# EAGLE design pc_healthypi_5.2_display_st7796 (EAGLE 9.6.2)
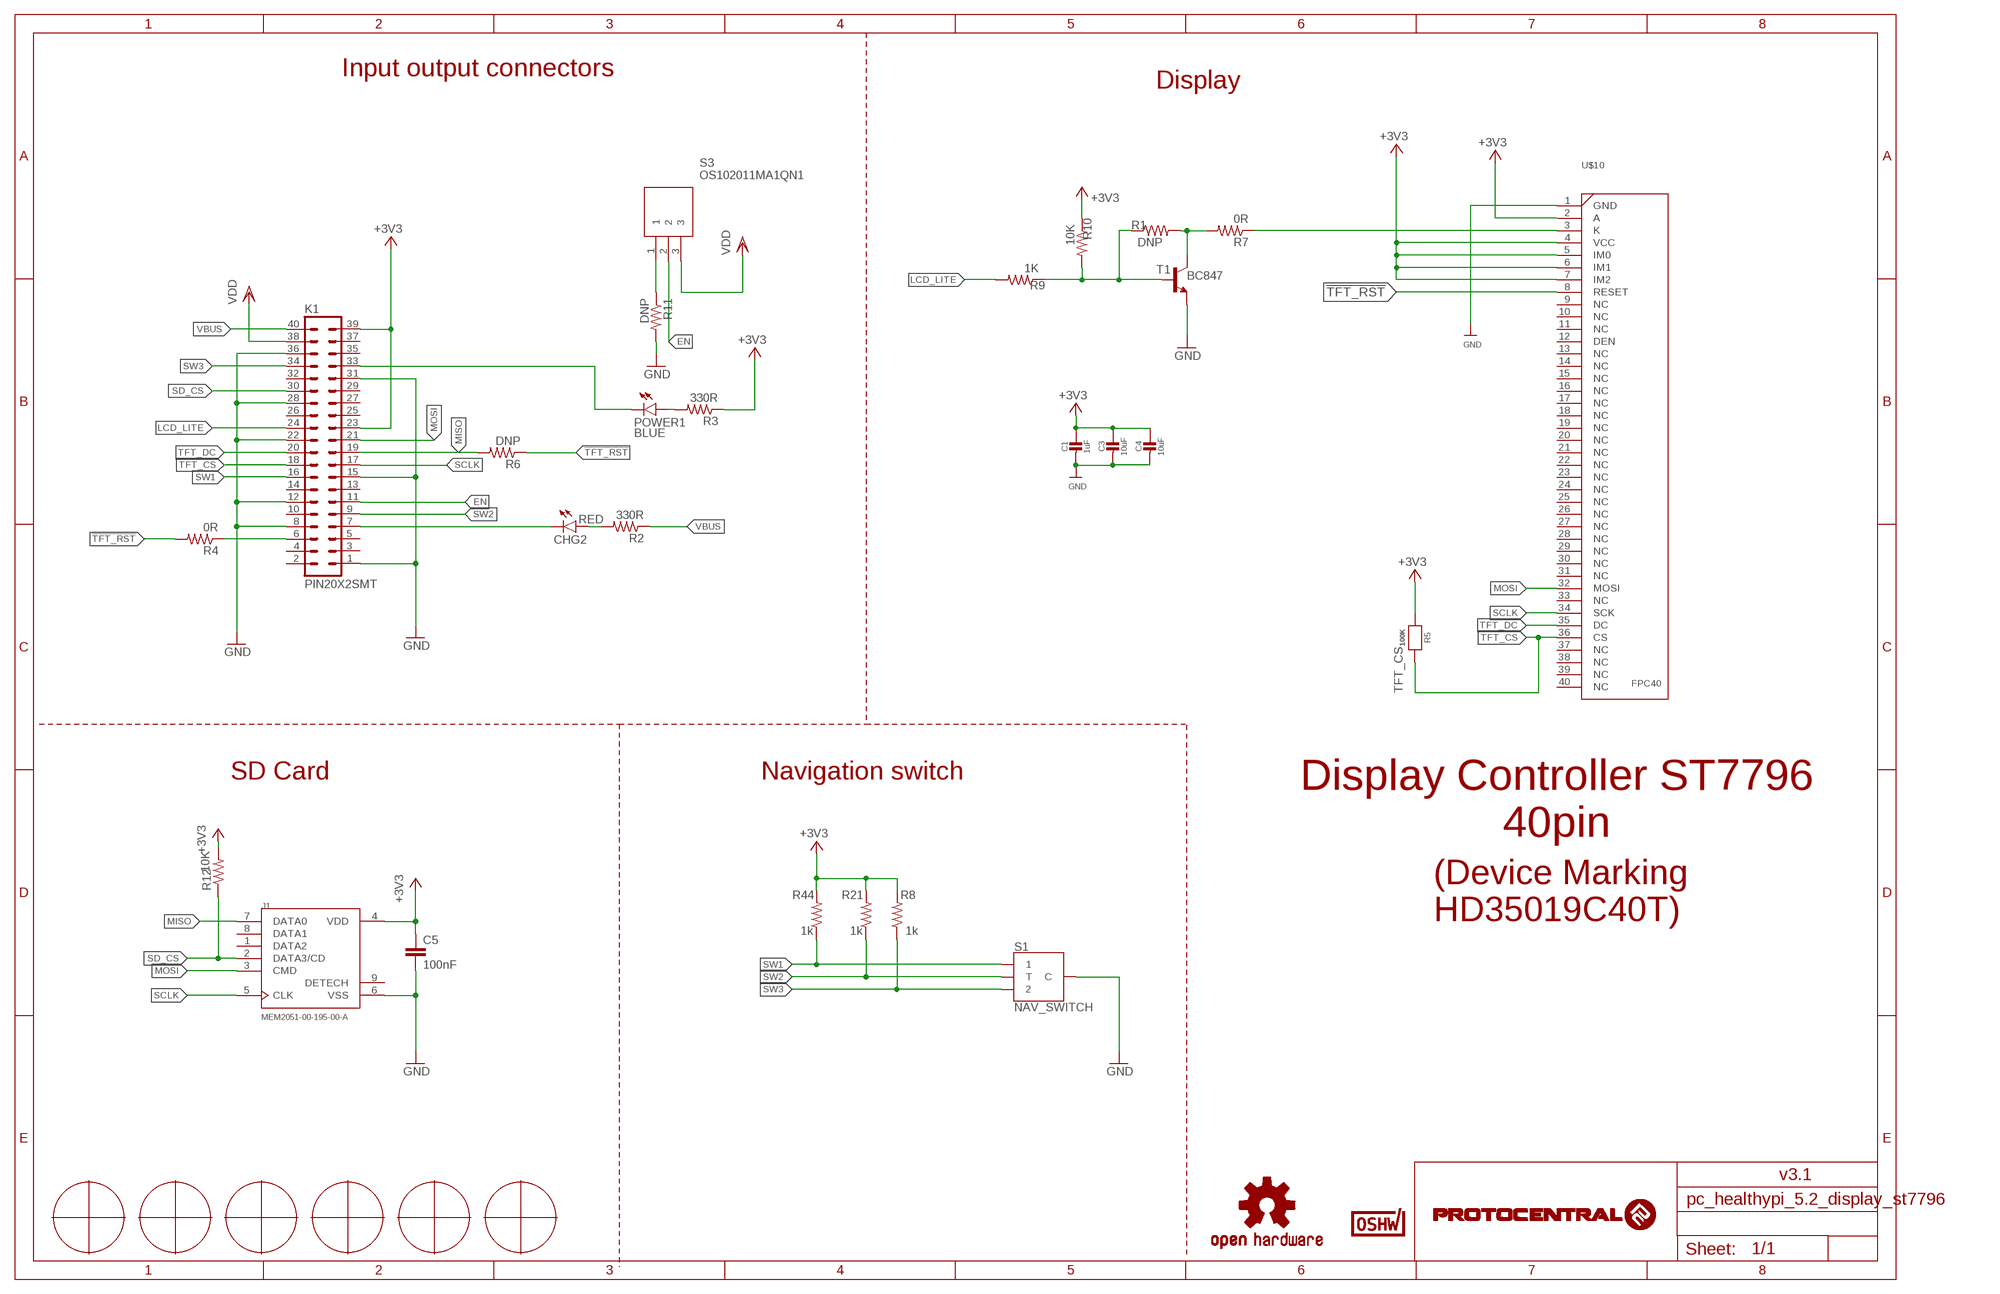
[diagram p0: schematic, sheet 1]

## Parts
C1  1uF  CAP_CERAMIC0805-NOOUTLINE  [0805-NO]
C3  10uF  CAP_CERAMIC0805-NOOUTLINE  [0805-NO]
C4  10uF  CAP_CERAMIC0805-NOOUTLINE  [0805-NO]
C5  100nF  C-EUC0402  [C0402]
CHG2  RED  LEDCHIPLED_0603  [CHIPLED_0603]
J1  MEM2051-00-195-00-A  [GCT_MEM2051-00-195-00-A]
K1  PIN20X2SMT  [20X2SMT]
POWER1  BLUE  LEDCHIPLED_0603  [CHIPLED_0603]
R1  DNP  R-US_R0402  [R0402]
R2  330R  R-US_R0402  [R0402]
R3  330R  R-US_R0402  [R0402]
R4  0R  R-US_R0402  [R0402]
R5  100K  RESISTOR0805_NOOUTLINE  [0805-NO]
R6  DNP  R-US_R0402  [R0402]
R7  0R  R-US_R0805  [R0805]
R8  1k  RESISTOR0402  [0402]
R9  1K  R-US_R0402  [R0402]
R10  10K  R-US_R0402  [R0402]
R11  DNP  R-US_R0402  [R0402]
R12  10K  R-US_R0402  [R0402]
R21  1k  RESISTOR0402  [0402]
R44  1k  RESISTOR0402  [0402]
S1  NAV_SWITCH  [NAV_SWITCH]
S3  OS102011MA1QN1  [OS102011MA1QN1]
T1  BC847  MMBT2222ALT1-NPN-SOT23-BEC  [SOT23-BEC]
U$1  FUDCIALPOINTS  [FIDUCIALPOINTS]
U$3  FUDCIALPOINTS  [FIDUCIALPOINTS]
U$5  OSHW-LOGOM  [OSHW-LOGO-M]
U$7  FUDCIALPOINTS  [FIDUCIALPOINTS]
U$8  FUDCIALPOINTS  [FIDUCIALPOINTS]
U$10  FPC40  [FPC40PIN]
U$13  CERT-SMALL  [CERT-SMALL-SILK]
U$23  FUDCIALPOINTS  [FIDUCIALPOINTS]
U$25  FUDCIALPOINTS  [FIDUCIALPOINTS]

## Nets
!TFT_RST: R4.2 R6.1 U$10.8(RESET)
+3V3: C1.1 C3.1 C4.1 C5.1 J1.4(VDD) K1.23 K1.39 R3.1 R5.2 R8.2 R10.1 R12.2 R21.2 R44.2 U$10.2(A) U$10.4(VCC) U$10.5(IM0) U$10.6(IM1) U$10.7(IM2)
EN: K1.11 S3.2
GND: C1.2 C3.2 C4.2 C5.2 J1.6(VSS) K1.1 K1.8 K1.12 K1.15 K1.22 K1.28 K1.31 K1.36 R11.2 S1.C T1.E U$10.1(GND)
LCD_LITE: K1.24 R9.2
LED1: K1.33 POWER1.C
MISO: J1.7(DATA0) K1.19 R6.2
MOSI: J1.3(CMD) K1.21 U$10.32(MOSI)
N$1: R1.2 R7.2 T1.C
N$2: CHG2.C K1.7
N$3: K1.6 R4.1
N$4: R7.1 U$10.3(K)
N$5: POWER1.A R3.2
N$6: CHG2.A R2.2
N$8: R11.1 S3.1
N$10: R1.1 R9.1 R10.2 T1.B
SCLK: J1.5(CLK) K1.17 U$10.34(SCK)
SD_CS: J1.2(DATA3/CD) K1.30 R12.1
SW1: K1.16 R44.1 S1.1
SW2: K1.9 R21.1 S1.T
SW3: K1.34 R8.1 S1.2
TFT_CS: K1.18 R5.1 U$10.36(CS)
TFT_DC: K1.20 U$10.35(DC)
VBUS: K1.40 R2.1
VDD: K1.38 S3.3
Unconnected: J1.1(DATA2) J1.8(DATA1) J1.9(DETECH) K1.2 K1.3 K1.4 K1.5 K1.10 K1.13 K1.14 K1.25 K1.26 K1.27 K1.29 K1.32 K1.35 K1.37 U$10.9(NC) U$10.10(NC) U$10.11(NC) U$10.12(DEN) U$10.13(NC) U$10.14(NC) U$10.15(NC) U$10.16(NC) U$10.17(NC) U$10.18(NC) U$10.19(NC) U$10.20(NC) U$10.21(NC) U$10.22(NC) U$10.23(NC) U$10.24(NC) U$10.25(NC) U$10.26(NC) U$10.27(NC) U$10.28(NC) U$10.29(NC) U$10.30(NC) U$10.31(NC) U$10.33(NC) U$10.37(NC) U$10.38(NC) U$10.39(NC) U$10.40(NC)

## Notes on the sheet
- Input output connectors
- Display
- SD Card | Navigation switch
- Display Controller ST7796
  40pin
- (Device Marking
  HD35019C40T)
- v3.1

## Library data of the parts
C1 C3 C4 = microbuilder:CAP_CERAMIC: Ceramic Capacitors For new designs, use the packages preceded by an '_' character since they are more reliable: The following footprints should be used on most boards: _0402 - Standard footprint for regular board layouts _0603 - Standard footprint for regular board layouts _0805 - Standard footprint for regular board layouts _1206 - Standard footprint for regular board layouts For extremely tight-pitch boards where space is at a premium, the following 'micro-pitch' footprints can be used (smaller pads, no silkscreen outline, etc.): _0402MP - Micro-pitch footprint for very dense/compact boards _0603MP - Micro-pitch footprint for very dense/compact boards _0805MP - Micro-pitch footprint for very dense/compact boards _1206MP - Micro-pitch footprint for very dense/compact boards
C5 = rcl:C-EU: CAPACITOR, European symbol
CHG2 POWER1 = led:LED: LED OSRAM: - CHIPLED LG R971, LG N971, LY N971, LG Q971, LY Q971, LO R971, LY R971 LH N974, LH R974 LS Q976, LO Q976, LY Q976 LO Q996 - Hyper CHIPLED LW Q18S LB Q993, LB Q99A, LB R99A - SideLED LS A670, LO A670, LY A670, LG A670, LP A670 LB A673, LV A673, LT A673, LW A673 LH A674 LY A675 LS A676, LA A676, LO A676, LY A676, LW A676 LS A679, LY A679, LG A679 - Hyper Micro SIDELED® LS Y876, LA Y876, LO Y876, LY Y876 LT Y87S - SmartLED LW L88C, LW L88S LB L89C, LB L89S, LG L890 LS L89K, LO L89K, LY L89K LS L896, LA L896, LO L896, LY L896 - TOPLED LS T670, LO T670, LY T670, LG T670, LP T670 LSG T670, LSP T670, LSY T670, LOP T670, LYG T670 LG T671, LOG T671, LSG T671 LB T673, LV T673, LT T673, LW T673 LH T674 LS T676, LA T676, LO T676, LY T676, LB T676, LH T676, LSB T676, LW T676 LB T67C, LV T67C, LT T67C, LS T67K, LO T67K, LY T67K, LW E67C LS E67B, LA E67B, LO E67B, LY E67B, LB E67C, LV E67C, LT E67C LW T67C LS T679, LY T679, LG T679 LS T770, LO T770, LY T770, LG T770, LP T770 LB T773, LV T773, LT T773, LW T773 LH T774 LS E675, LA E675, LY E675, LS T675 LS T776, LA T776, LO T776, LY T776, LB T776 LHGB T686 LT T68C, LB T68C - Hyper Mini TOPLED® LB M676 - Mini TOPLED Santana® LG M470 LS M47K, LO M47K, LY M47K Source: http://www.osram.convergy.de LUXEON: - LUMILED® LXK2-PW12-R00, LXK2-PW12-S00, LXK2-PW14-U00, LXK2-PW14-V00 LXK2-PM12-R00, LXK2-PM12-S00, LXK2-PM14-U00 LXK2-PE12-Q00, LXK2-PE12-R00, LXK2-PE12-S00, LXK2-PE14-T00, LXK2-PE14-U00 LXK2-PB12-K00, LXK2-PB12-L00, LXK2-PB12-M00, LXK2-PB14-N00, LXK2-PB14-P00, LXK2-PB14-Q00 LXK2-PR12-L00, LXK2-PR12-M00, LXK2-PR14-Q00, LXK2-PR14-R00 LXK2-PD12-Q00, LXK2-PD12-R00, LXK2-PD12-S00 LXK2-PH12-R00, LXK2-PH12-S00 LXK2-PL12-P00, LXK2-PL12-Q00, LXK2-PL12-R00 Source: www.luxeon.com KINGBRIGHT: KA-3528ASYC Source: www.kingbright.com
J1 = circuitects:MEM2051-00-195-00-A: Connector, Memory Card, Micro Sd, 8 Position, 1.1mm, Full Reel Check availability <https://pricing.snapeda.com/parts/MEM2051-00-195-00-A/Global%20Connector%20Technology/view-part?ref=eda>; AVAILABILITY: In Stock; DESCRIPTION: 9 (8 + 1) Position Card Connector microSD Surface Mount, Right Angle Gold, 1.95mm profile, Normally open switch, Push push, Top mount; MF: Global Connector Technology; MP: MEM2051-00-195-00-A; PACKAGE: None; PRICE: None; PURCHASE-URL: https://pricing.snapeda.com/search/part/MEM2051-00-195-00-A/?ref=eda
K1 = circuitects:PIN20X2
R1-R4 R6 R7 R9-R11 = rcl:R-US_: RESISTOR, American symbol; SPICEPREFIX: R
R5 = microbuilder:RESISTOR: Resistors For new designs, use the packages preceded by an '_' character since they are more reliable: The following footprints should be used on most boards: _0402 - Standard footprint for regular board layouts _0603 - Standard footprint for regular board layouts _0805 - Standard footprint for regular board layouts _1206 - Standard footprint for regular board layouts For extremely tight-pitch boards where space is at a premium, the following 'micro-pitch' footprints can be used (smaller pads, no silkscreen outline, etc.): _0402MP - Micro-pitch footprint for very dense/compact boards _0603MP - Micro-pitch footprint for very dense/compact boards _0805MP - Micro-pitch footprint for very dense/compact boards _1206MP - Micro-pitch footprint for very dense/compact boards
R8 R21 R44 = SparkFun-Resistors:RESISTOR: Generic Resistor Package
R12 = rcl:R-US_: RESISTOR, American symbol
S1 = SparkFun-Switches:NAV_SWITCH: Navigation Switch Three way navigation switch. Commonly used as up/down/select on MP3 players. Schematic element and footprint production proven. SparkFun Products Surface Mount Navigation Switch <https://www.sparkfun.com/products/8184> (COM-08184) Used on SparkFun MP3 Trigger <https://www.sparkfun.com/products/13720>; PROD_ID: SWCH-08301; SF_SKU: COM-08184
S3 = circuitects:OS102011MA1QN1: Switch Slide Right Angle SPDT 0.1A 12VDC Through Hole Slide Switch SPDT On-On 0.1 A@ 12 V dc Slide Source: Datasheet <http://www.ckswitches.com/media/1428/os.pdf> Check availability <https://pricing.snapeda.com/parts/OS102011MA1QN1/C%20%26%20K/view-part?ref=eda>; AVAILABILITY: In Stock; DESCRIPTION: C & K Through Hole Slide Switch Single Pole Double Throw (SPDT) Latching 100 mA@ 12 V dc Slide; MF: C & K; MP: OS102011MA1QN1; PACKAGE: None; PRICE: None; PURCHASE-URL: https://pricing.snapeda.com/search/part/OS102011MA1QN1/?ref=eda
T1 = transistor:*-NPN-: NPN Transistror BF959 corrected 2008.03.06
U$1 U$3 U$7 U$8 U$23 U$25 = circuitects:FUDCIALPOINTS
U$5 = SparkFun:OSHW-LOGO: Open Source Hardware Logo This logo indicates the piece of hardware it is found on incorporates a OSHW license and/or adheres to the definition of open source hardware found here: http://freedomdefined.org/OSHW
U$10 = circuitects:FPC40
U$13 = OSHWA:CERT

## Net classes
1 power: width 0.178 mm
2 Clock: width 0.089 mm, clearance 0.178 mm
4 USBpair: width 0.102 mm, drill 0.1 mm, clearance 0.15 mm to class 3

## Board
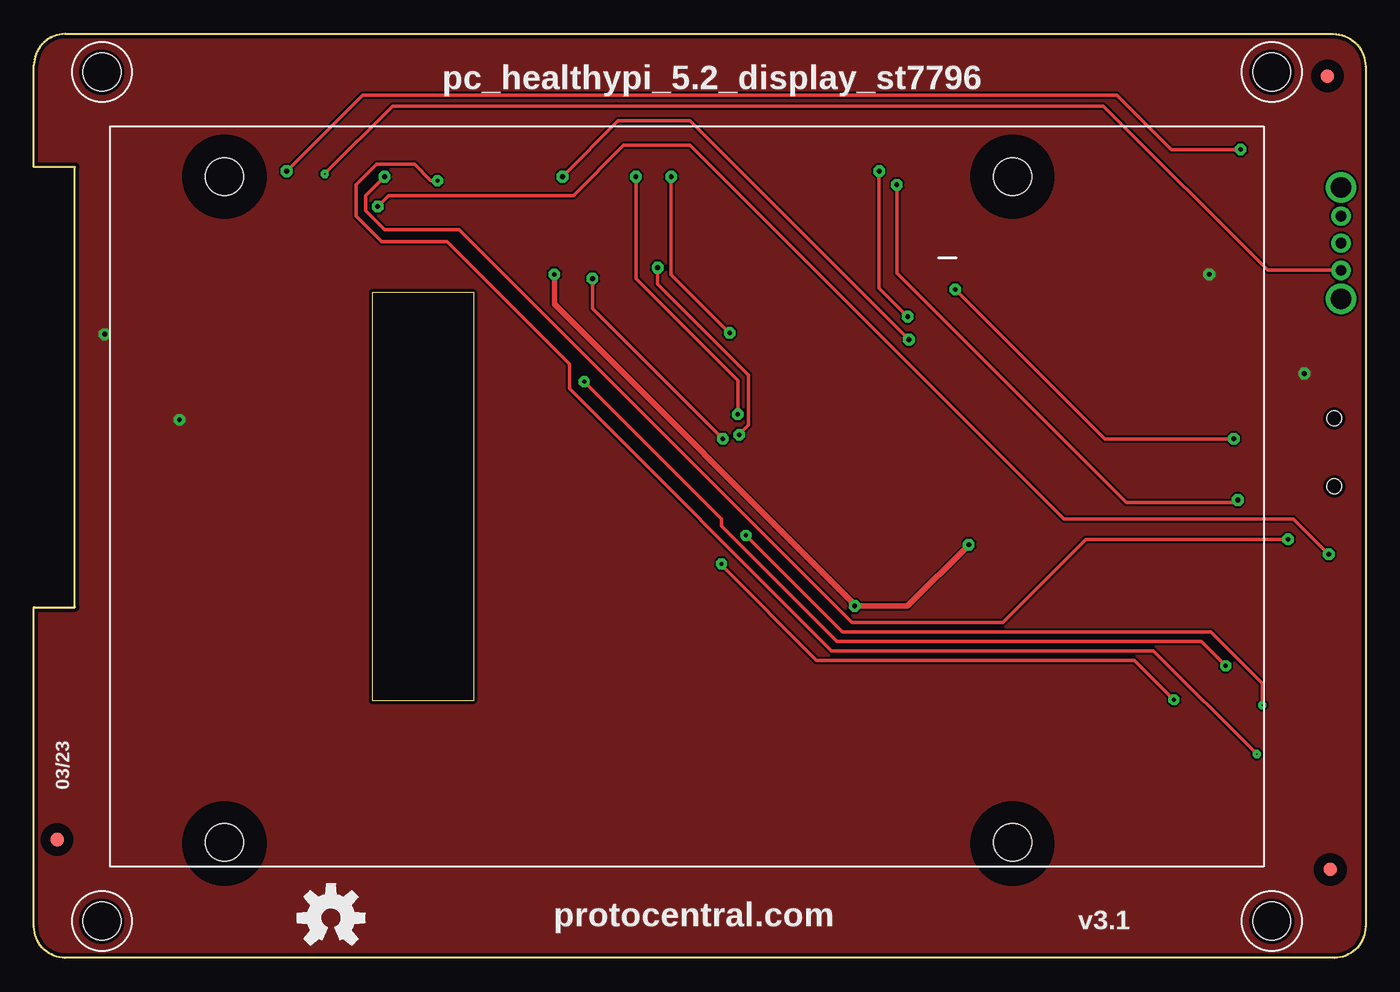
[diagram p1: board, top side]
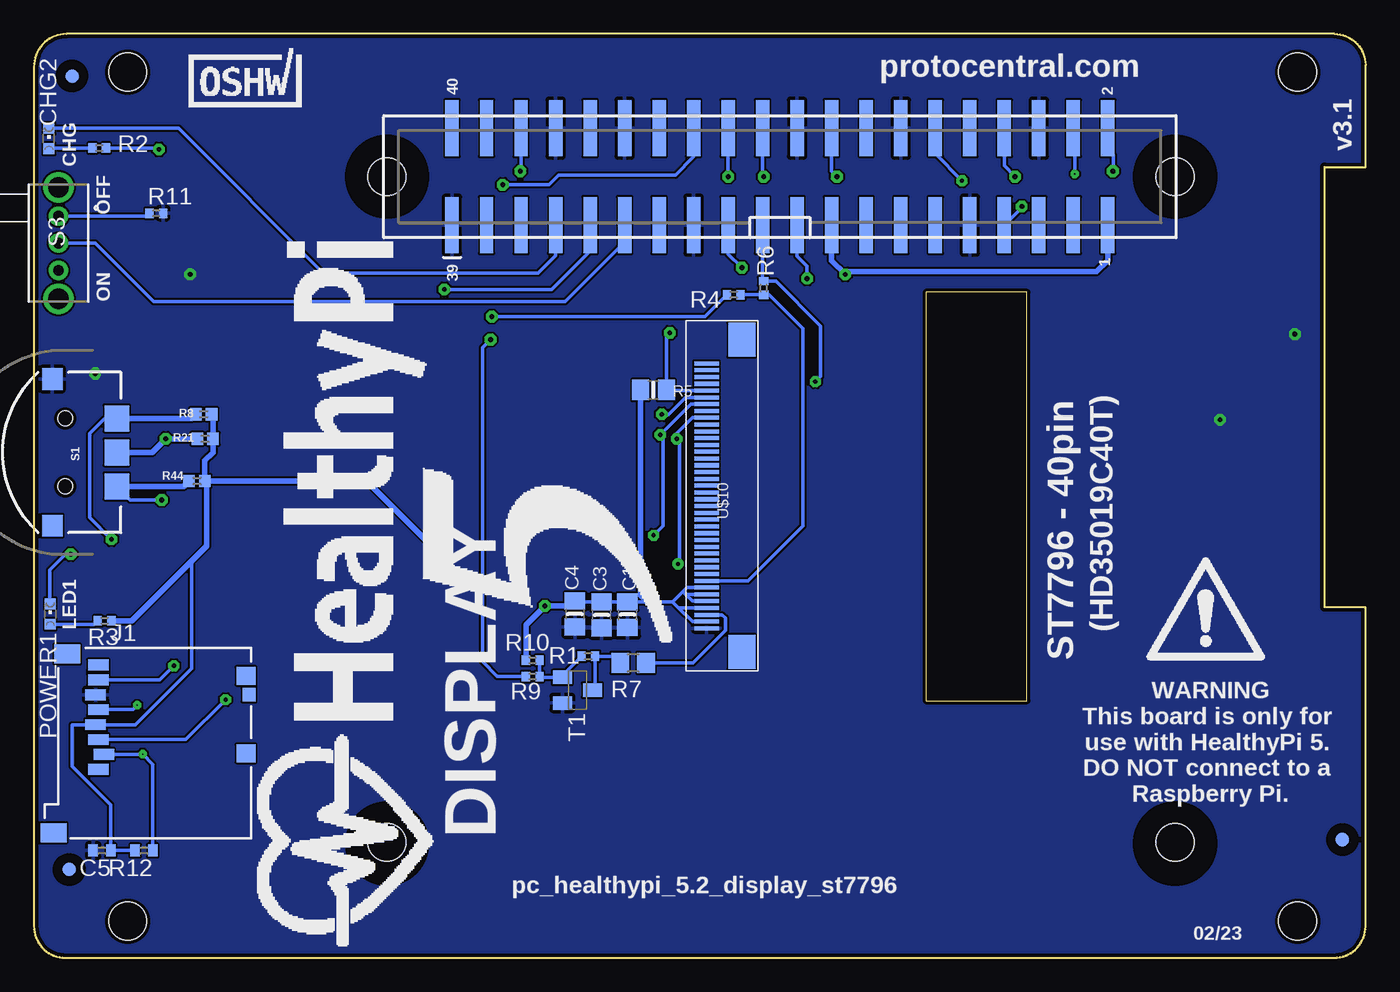
[diagram p2: board, bottom side, seen from below]

Size 98 x 68 mm. Coordinates in mm from the lower left corner, seen from the top.
Outline: 98,65.6 98,2.3 arc-90 95.7,0 2.3,0 arc-90 0,2.3 0,25.8 3,25.8 3,58.2 0,58.2 0,65.7 arc-90 2.3,68 95.6,68 arc-90 98,65.6
Outline: 32.35,18.91 24.92,18.91 24.92,48.99 32.35,48.99 32.35,18.91
Copper layers (1*16): Top 0.035mm / dielectric 1.5mm / Bottom 0.035mm
Design rules "Circuitects-Rules *": minimum track width 6mil, minimum drill 0.1mm, track to track 6mil, track to pad 6mil, pad to pad 6mil, via to via 6mil, smd to smd 6mil, copper to edge 10mil, drill to drill 4mil, minimum pad ring 12mil, minimum via ring 10mil, stop-mask expansion 4mil, vias tented up to drill 25mil, thermal gap 10mil
Holes 2.8 mm at 72.02,8.5 72.02,57.5 14.02,57.5 14.02,8.5 5,2.7 5,65.2 91.1,2.7 91.1,65.2
tRestrict: area 70.5,6.8 to 73.6,9.9; area 70.5,55.9 to 73.6,59; area 12.5,6.8 to 15.6,9.9; area 12.5,55.9 to 15.6,59
bRestrict: area 70.5,55.9 to 73.6,59; area 12.5,55.9 to 15.6,59; area 12.5,6.8 to 15.6,9.9; area 70.5,6.8 to 73.6,9.9

### Footprints (pad centres in the part's own frame; a part is rotated, then mirrored left to right if it is on the bottom)
0805-NO = smd 1.24 x 1.5: 1 -0.95,0; 2 0.95,0
C0402 = smd 0.7 x 0.9: 1 -0.65,0; 2 0.65,0
CHIPLED_0603 = smd 0.8 x 0.8: A 0,-0.75; C 0,0.75
GCT_MEM2051-00-195-00-A = smd 0.8 x 1.5: 1 1.94,-3.66; 2 0.84,-3.26; 3 -0.26,-3.66; 4 -1.36,-3.86; 5 -2.46,-3.66; 6 -3.56,-3.86; 7 -4.66,-3.66; 8 -5.76,-3.66 | smd 1 x 0.95: 9 -3.56,7.425 | smd 1.3 x 1.4: P1 -4.95,7.2; P2 0.75,7.2 | smd 1.4 x 1.9: P3 6.6,-6.95; P4 -6.55,-5.95
20X2SMT = smd 4.14 x 0.991: 1 -3.669,24.13; 2 3.469,24.13; 3 -3.669,21.59; 4 3.469,21.59; 5 -3.669,19.05; 6 3.469,19.05; 7 -3.669,16.51; 8 3.469,16.51; 9 -3.669,13.97; 10 3.469,13.97; 11 -3.669,11.43; 12 3.469,11.43; 13 -3.669,8.89; 14 3.469,8.89; 15 -3.669,6.35; 16 3.469,6.35; 17 -3.669,3.81; 18 3.469,3.81; 19 -3.669,1.27; 20 3.469,1.27; 21 -3.669,-1.27; 22 3.469,-1.27; 23 -3.669,-3.81; 24 3.469,-3.81; 25 -3.669,-6.35; 26 3.469,-6.35; 27 -3.669,-8.89; 28 3.469,-8.89; 29 -3.669,-11.43; 30 3.469,-11.43; 31 -3.669,-13.97; 32 3.469,-13.97; 33 -3.669,-16.51; 34 3.469,-16.51; 35 -3.669,-19.05; 36 3.469,-19.05; 37 -3.669,-21.59; 38 3.469,-21.59; 39 -3.669,-24.13; 40 3.469,-24.13
R0402 = smd 0.6 x 0.7: 1 -0.5,0; 2 0.5,0
R0805 = smd 1.3 x 1.5: 1 -0.95,0; 2 0.95,0
0402 = smd 0.85 x 0.9: 1 -0.58,0; 2 0.58,0
R0402' = smd 0.7 x 0.9: 1 -0.65,0; 2 0.65,0
NAV_SWITCH = smd 1.9 x 1.8: 1 -2.5,-3.8; 2 2.5,-3.8; T 0,-3.8 | smd 1.6 x 1.5: C 5.4,0.95; NC -5.4,0.95 | hole 1.1: -2.5,0; 2.5,0
OS102011MA1QN1 = drill 0.8 pad 1.3: 1 -2,0; 2 0,0; 3 2,0 | drill 1.5 pad 2.25: 4 -4.1,0; 5 4.1,0
SOT23-BEC = smd 1 x 1.4: B -0.95,-1.1; C 0,1.1; E 0.95,-1.1
FIDUCIALPOINTS = smd 1 x 1: TP 0,0
FPC40PIN = smd 0.3 x 1.8: 1 -9.75,0; 2 -9.25,0; 3 -8.75,0; 4 -8.25,0; 5 -7.75,0; 6 -7.25,0; 7 -6.75,0; 8 -6.25,0; 9 -5.75,0; 10 -5.25,0; 11 -4.75,0; 12 -4.25,0; 13 -3.75,0; 14 -3.25,0; 15 -2.75,0; 16 -2.25,0; 17 -1.75,0; 18 -1.25,0; 19 -0.75,0; 20 -0.25,0; 21 0.25,0; 22 0.75,0; 23 1.25,0; 24 1.75,0; 25 2.25,0; 26 2.75,0; 27 3.25,0; 28 3.75,0; 29 4.25,0; 30 4.75,0; 31 5.25,0; 32 5.75,0; 33 6.25,0; 34 6.75,0; 35 7.25,0; 36 7.75,0; 37 8.25,0; 38 8.75,0; 39 9.25,0; 40 9.75,0 | smd 2.5 x 2: P$41 -11.5,-2.6; P$42 11.5,-2.6

### Placement (x,y rotation side)
C1  54.32,25.25 270 bottom
C3  56.23,25.23 270 bottom
C4  58.19,25.3 270 bottom
C5  93,7.9 180 bottom
CHG2  96.9,60.3 0 bottom
J1  89.6,15.8 270 bottom
K1  43.1,57.6 90 bottom
POWER1  96.8,25.3 0 bottom
R1  57.2,22.2 0 bottom
R2  93.2,59.6 180 bottom
R3  92.8,24.8 180 bottom
R4  46.5,48.8 0 bottom
R5  52.41,41.8 180 bottom
R6  44.3,49.3 90 bottom
R7  53.9,21.7 180 bottom
R8  85.5,40 0 bottom
R9  61.3,20.7 180 bottom
R10  61.3,21.9 0 bottom
R11  89,54.8 0 bottom
R12  10K  [R0402']  89.9,7.9 180 bottom
R21  85.4,38.2 0 bottom
R44  86,35.1 0 bottom
S1  95.7,37.2 90 bottom
S3  96.2,52.6 270 bottom
T1  58,19.7 270 bottom
U$1  95.2,64.9 0 bottom
U$3  95.2,64.9 0 top
U$5  21.86,2.93 0 top
U$7  1.7,8.7 0 top
U$8  95.4,6.5 0 top
U$9  [WARNINGSYM]  16.2,21.8 0 bottom
U$10  48.5,34 90 bottom
U$13  82.46,62.6 0 bottom
U$20  [HEALTHYPIV5LOGO]  51.1,0.9 90 bottom
U$23  95.4,6.5 0 bottom
U$25  1.7,8.7 0 bottom

### Tracks (layer width: path | path; a pad name or v marks a point on that pad's centre or on a via)
!TFT_RST
  Bottom 0.254: U$10.8 45.45,27.75 41.4,31.8 41.4,46.3 43.9,48.8 R6.1 R4.2
+3V3  (via drill 0.35)
  Top 0.406: v38.3,50.3 38.3,48.1 60.4,26 v60.4,25.9 64.3,25.9 v68.8,30.4
  Bottom 0.254: U$10.4 50.55,25.75 | 50.55,25.75 51,26.2 | 51,26.2 52.9,26.2 C1.1 54.34,26.18 C3.1 58.12,26.18 C4.1 | U$10.7 49.95,27.25 50.25,26.95 | 50.25,26.95 51,26.2 | U$10.6 50.05,26.75 | 50.05,26.75 50.25,26.95 | U$10.5 49.55,26.25 50.05,26.75 | U$10.2 49.55,24.75 50.55,25.75 | R12.2 C5.1 92.35,11.25 95.2,14.1 95.2,17.16 J1.4 90.54,17.16 86.4,21.3 86.4,29 86.5,29.1
  Bottom 0.406: C4.1 58.54,25.9 v60.4,25.9 61.8,24.5 R10.1 | R5.2 53.36,26.66 52.9,26.2 | K1.39 18.97,51.33 19.8,50.5 38.1,50.5 v38.3,50.3 v38.31,50.31 38.29,50.32 39.29,51.32 K1.23 | R44.2 85.42,36.6 84.82,37.2 R21.2 84.82,39.9 R8.2 | R44.2 73.5,35.1 v68.8,30.4 | R3.1 90.8,24.8 86.5,29.1 85.3,30.3 85.3,35.1 R44.2
EN
  Bottom 0.254: K1.11 54.53,52.67 58.9,48.3 89.2,48.3 93.5,52.6 S3.2
GND  (via drill 0.35)
  other vias: 10.7,39.6 5.2,45.9 93.5,43 86.5,50.3
  pour Top: 99,-0.2 1.94,-0.2 arc-90 -1.1,1.58 -1.1,65.26 arc-90 1.51,68.1 96.18,68.1 arc-90 99,66.18
  pour Bottom: 99,-0.2 2.27,-0.2 arc-90 -1.1,1.74 -1.1,65.28 arc-90 1.23,68.1 95.86,68.1 arc-90 99,66.2
LCD_LITE  (via drill 0.35)
  Top 0.254: v64.4,45.5 48.3,61.6 43,61.6 v38.9,57.5
  Bottom 0.254: R9.2 63.9,20.7 65,21.8 65,44.9 v64.4,45.5 | K1.24 39.29,57.89 v38.9,57.5
LED1  (via drill 0.35)
  Top 0.254: v25.3,55.3 26.1,56.1 39.7,56.1 43.4,59.8 48.3,59.8 75.8,32.3 92.7,32.3 v95.3,29.7
  Bottom 0.254: K1.33 25.3,55.22 v25.3,55.3 | v95.3,29.7 95.7,29.7 96.85,28.55 96.85,26.1 POWER1.C
MISO  (via drill 0.3)
  Top 0.254: v40.5,42.4 50.6,32.3 50.6,31.8 59.1,23.3 85.9,23.3 v87.7,21.5
  Bottom 0.254: K1.19 44.37,49.87 R6.2 43.4,49.8 40.1,46.5 40.1,42.8 v40.5,42.4 | J1.7 88.74,20.46 v87.7,21.5
MOSI  (via drill 0.3, 0.35)
  Top 0.254: v41.1,50 41.1,47.8 v50.7,38.2 | v83.9,19 81,21.9 57.6,21.9 50.6,28.9 v50.6,29
  Bottom 0.254: U$10.32 49.55,39.75 50.7,38.6 v50.7,38.2 50.5,38 50.5,29.1 v50.6,29 | K1.21 41.83,51.63 41.1,50.9 v41.1,50 | J1.3 86.84,16.06 v83.9,19
N$1
  Bottom 0.254: R7.2 55.35,22.2 R1.2 56.7,19.9 T1.C
N$2
  Bottom 0.254: K1.7 59.61,51.69 60.9,50.4 76.7,50.4 87.35,61.05 CHG2.C
N$3  (via drill 0.35)
  Top 0.254: v62.2,57.9 62.2,49.3 v64.3,47.2
  Bottom 0.254: v64.3,47.2 48.6,47.2 R4.1 | v62.2,57.9 62.15,57.95 K1.6
N$4
  Bottom 0.254: U$10.3 47.35,25.25 47.1,25 47.1,24.1 49.5,21.7 R7.1
N$5
  Bottom 0.254: POWER1.A 93.55,24.55 R3.2
N$6
  Bottom 0.254: CHG2.A 96.85,59.6 R2.2
N$8
  Bottom 0.254: S3.1 89.7,54.6 R11.1
N$10
  Bottom 0.254: R1.1 59.1,20.8 T1.B 60.75,20.65 R9.1 R10.2
SCLK  (via drill 0.1, 0.3, 0.35)
  Top 0.254: v51.9,38.5 52.6,39.2 52.6,42.9 45.9,49.6 v45.9,50.8 | v52.4,31.1 59.5,24 86.6,24 90.4,20.2 v90.4,18.6
  Bottom 0.254: U$10.34 49.65,40.75 v51.9,38.5 51.7,38.3 51.7,31.8 v52.4,31.1 | K1.17 46.91,51.81 v45.9,50.8 | v90.4,18.6 90.7,18.3 93.22,18.3 J1.5
SD_CS  (via drill 0.1, 0.3)
  Top 0.254: v29.7,57.2 29.2,57.2 28,58.4 25.2,58.4 23.7,56.9 23.7,54.6 25.6,52.7 30.4,52.7 39.4,43.7 39.4,41.9 58.7,22.6 82.4,22.6 v90,15
  Bottom 0.254: J1.2 90,14.96 v90,15 89.25,14.25 R12.1 | K1.30 31.67,59.17 v29.7,57.2
SW1  (via drill 0.35)
  Top 0.254: v63.5,56.9 63.5,50.4 80.4,33.5 88.4,33.5 v88.6,33.7
  Bottom 0.254: K1.16 49.45,58.95 50.8,57.6 59.4,57.6 60.1,56.9 v63.5,56.9 | v88.6,33.7 90.9,33.7 S1.1
  Bottom 0.406: S1.1 86.98,34.7 R44.1
SW2  (via drill 0.35)
  Top 0.254: v67.8,49.2 78.8,38.2 v88.3,38.2
  Bottom 0.254: K1.9 57.07,52.03 59.9,49.2 v67.8,49.2
  Bottom 0.406: S1.T 89.3,37.2 v88.3,38.2 R21.1
SW3  (via drill 0.35)
  Top 0.254: v25.8,57.5 24.4,56.1 24.4,55 25.8,53.6 31.3,53.6 60.2,24.7 71.3,24.7 77.4,30.8 v92.3,30.8
  Bottom 0.254: K1.34 26.59,58.29 v25.8,57.5 | v92.3,30.8 93.9,32.4 93.9,38.6 92.8,39.7 S1.2
  Bottom 0.406: S1.2 86.38,39.7 R8.1
TFT_CS  (via drill 0.35)
  Top 0.254: v51.2,46 46.9,50.3 v46.9,57.5
  Bottom 0.254: U$10.36 51.41,41.75 R5.1 51.46,45.74 v51.2,46 | K1.18 v46.91,57.51 v46.9,57.5
TFT_DC  (via drill 0.35)
  Top 0.254: v51.8,40 51.8,42.5 44.3,50 v44.3,57.5
  Bottom 0.254: U$10.35 50.05,41.25 51.3,40 v51.8,40 | K1.20 44.37,57.57 v44.3,57.5
VBUS  (via drill 0.35)
  Top 0.254: v18.6,57.9 24.2,63.5 79.7,63.5 83.7,59.5 v88.8,59.5
  Bottom 0.254: K1.40 18.97,59.47 18.57,59.07 18.57,57.93 v18.6,57.9 | v88.8,59.5 88.9,59.6 R2.1
VDD  (via drill 0.1)
  Top 0.254: v21.4,57.7 26.4,62.7 78.7,62.7 90.8,50.6 S3.3
  Bottom 0.254: K1.38 21.4,60.96 v21.4,57.7

### Text on the board
tPlace: pc_healthypi_5.2_display_st7796 | 03/23 | v3.1 | protocentral.com
bPlace: protocentral.com | 2 | 40 | CHG | v3.1 | OFF | 1 | ON | 39 | LED1 | (HD35019C40T) | ST7796 - 40pin | WARNING / This board is only for / use with HealthyPi 5. / DO NOT connect to a / Raspberry Pi. | DISPLAY | pc_healthypi_5.2_display_st7796 | 02/23